# EAGLE design Schema (EAGLE 4.14)
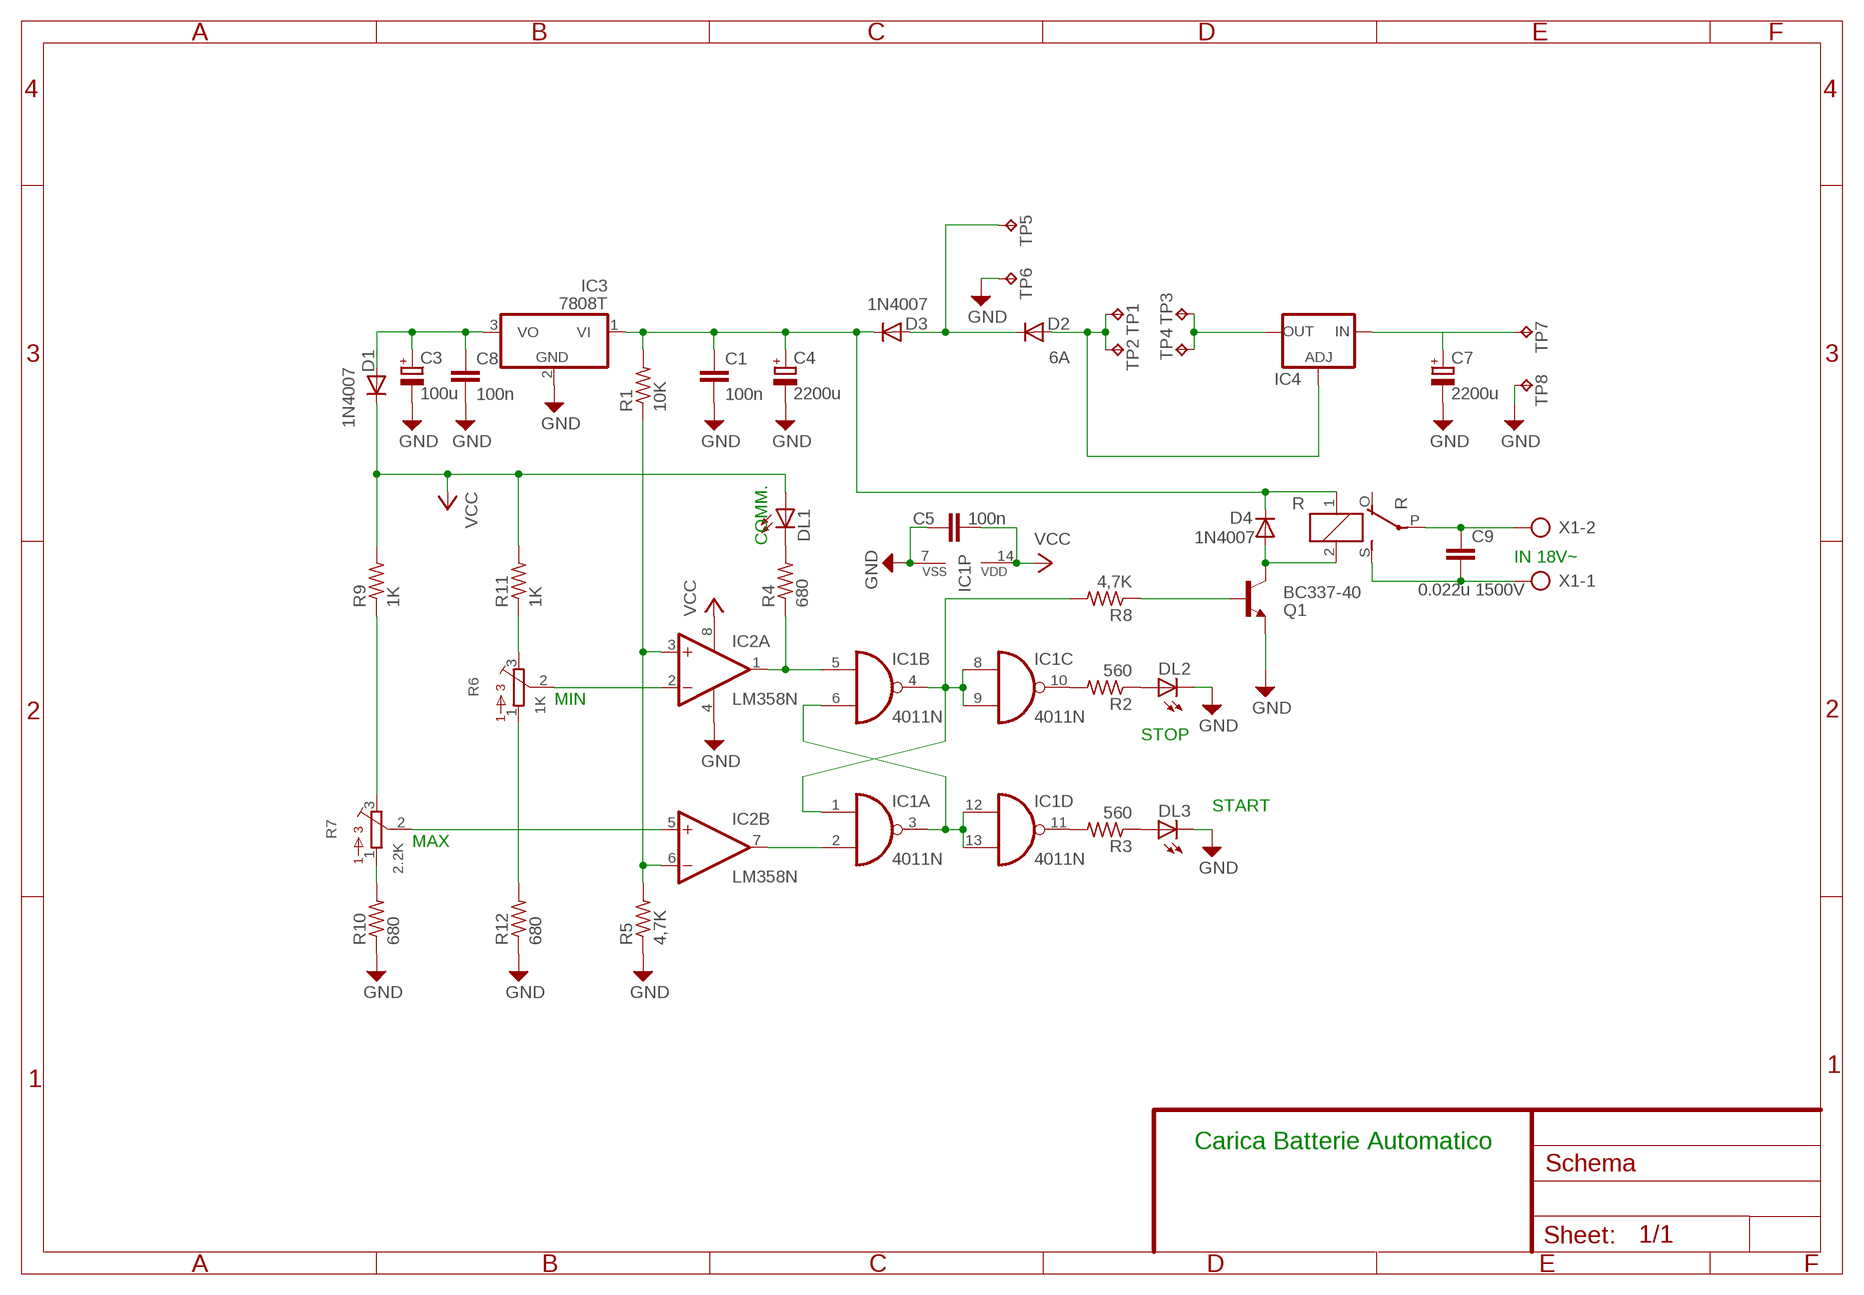
[diagram p0: schematic, sheet 1]

## Parts
C1  100n  C10/4  [C10B4]
C3  100u  CPOL-EUE5-10.5  [E5-10,5]
C4  2200u  CPOL-EUE5-13  [E5-13]
C5  100n  C-EU102-043X133  [C102-043X133]
C7  2200u  CPOL-EUE7.5-18  [E7,5-18]
C8  100n  C10/4  [C10B4]
C9  0.022u 1500V  C-EU225-087X268  [C225-087X268]
D1  1N4007  1N4004  [DO41-10]
D2  6A  MUR440RL  [C2673]
D3  1N4007  1N4004  [DO41-10]
D4  1N4007  1N4004  [DO41-10]
DL1  LED5MM  [LED5MM]
DL2  LED5MM  [LED5MM]
DL3  LED5MM  [LED5MM]
IC1  4011N  [DIL14]
IC2  LM358N  [DIL08]
IC3  7808T  [TO220H]
IC4  LM138-TO3  [TO3-K02]
Q1  BC337-40  [TO92]
R  E3206S  [E3206S]
R1  10K  R-US_0207/15  [0207/15]
R2  560  R-US_0207/15  [0207/15]
R3  560  R-US_0207/15  [0207/15]
R4  680  R-US_0207/15  [0207/15]
R5  4,7K  R-US_0207/15  [0207/15]
R6  1K  3386-G  [3386G]
R7  2.2K  3386-G  [3386G]
R8  4,7K  R-US_0207/15  [0207/15]
R9  1K  R-US_0207/15  [0207/15]
R10  680  R-US_0207/15  [0207/15]
R11  1K  R-US_0207/15  [0207/15]
R12  680  R-US_0207/15  [0207/15]
TP1  TP-052-TJ  [TJ-052]
TP2  TP-052-TJ  [TJ-052]
TP3  TP-052-TJ  [TJ-052]
TP4  TP-052-TJ  [TJ-052]
TP5  TP-052-TJ  [TJ-052]
TP6  TP-052-TJ  [TJ-052]
TP7  TP-052-TJ  [TJ-052]
TP8  TP-052-TJ  [TJ-052]
X1  AK500/2  [AK500/2]

## Nets
GND: C1.2 C3.- C4.- C5.1 C7.- C8.2 DL2.K(C) DL3.K(C) IC1.7(P:VSS) IC2.4(P:V-) IC3.2(GND) Q1.1(E) R5.1 R10.1 R12.1 TP6.1 TP8.1
N$1: IC1.5(B:I0) IC2.1(A:OUT) R4.1
N$2: IC2.2(A:-IN) R6.2
N$3: Q1.2(B) R8.1
N$4: DL1.K(C) R4.2
N$5: IC1.1(A:I0) IC1.4(B:O) IC1.8(C:I0) IC1.9(C:I1) R8.2
N$6: R6.3 R11.1
N$7: IC1.10(C:O) R2.2
N$8: IC1.11(D:O) R3.2
N$9: DL2.A R2.1
N$10: DL3.A R3.1
N$11: IC2.3(A:+IN) IC2.6(B:-IN) R1.1 R5.2
N$12: IC1.2(A:I1) IC2.7(B:OUT)
N$13: IC2.5(B:+IN) R7.2
N$14: C9.2 R.S(2:S) X1.1
N$15: D4.A Q1.3(C) R.2
N$16: R6.1 R12.2
N$17: C1.1 C4.+ D3.C D4.C IC3.1(VI) R1.2 R.1
N$18: C3.+ C8.1 D1.A IC3.3(VO)
N$19: D2.C D3.A TP5.1
N$20: R7.3 R9.1
N$21: R7.1 R10.2
N$22: D2.A IC4.2(ADJ) TP1.1 TP2.1
N$23: C7.+ IC4.1(IN) TP7.1
N$24: IC4.3(OUT) TP3.1 TP4.1
N$25: IC1.3(A:O) IC1.6(B:I1) IC1.12(D:I0) IC1.13(D:I1)
N$26: C9.1 R.P(2:P) X1.2
VCC: C5.2 D1.C DL1.A IC1.14(P:VDD) IC2.8(P:V+) R9.2 R11.2
Unconnected: R.O(2:O)

## Notes on the sheet
- COMM.
- IN 18V~
- MIN
- STOP
- START
- MAX
- Carica Batterie Automatico

## Library data of the parts
C1 C8 = capacitor-wima:C: CAPACITOR naming: grid - package width
C3 C4 C7 = rcl:CPOL-EU: POLARIZED CAPACITOR, European symbol
C5 C9 = rcl:C-EU: CAPACITOR, European symbol
D1 D3 D4 = diode:1N4004: DIODE general purpose rectifier, 1 A
D2 = diode:MUR440RL: DIODE ultra-fast recovery rectifier, Vrrm = 40 V, 4 A
DL1-DL3 = led:LED: LED OSRAM: - CHIPLED LG R971, LG N971, LY N971, LG Q971, LY Q971, LO R971, LY R971 LH N974, LH R974 LS Q976, LO Q976, LY Q976 LO Q996 - Hyper CHIPLED LW Q18S LB Q993, LB Q99A, LB R99A - SideLED LS A670, LO A670, LY A670, LG A670, LP A670 LB A673, LV A673, LT A673, LW A673 LH A674 LY A675 LS A676, LA A676, LO A676, LY A676, LW A676 LS A679, LY A679, LG A679 - Hyper Micro SIDELED® LS Y876, LA Y876, LO Y876, LY Y876 LT Y87S - SmartLED LW L88C, LW L88S LB L89C, LB L89S, LG L890 LS L89K, LO L89K, LY L89K LS L896, LA L896, LO L896, LY L896 - TOPLED LS T670, LO T670, LY T670, LG T670, LP T670 LSG T670, LSP T670, LSY T670, LOP T670, LYG T670 LG T671, LOG T671, LSG T671 LB T673, LV T673, LT T673, LW T673 LH T674 LS T676, LA T676, LO T676, LY T676, LB T676, LH T676, LSB T676, LW T676 LB T67C, LV T67C, LT T67C, LS T67K, LO T67K, LY T67K, LW E67C LS E67B, LA E67B, LO E67B, LY E67B, LB E67C, LV E67C, LT E67C LW T67C LS T679, LY T679, LG T679 LS T770, LO T770, LY T770, LG T770, LP T770 LB T773, LV T773, LT T773, LW T773 LH T774 LS E675, LA E675, LY E675, LS T675 LS T776, LA T776, LO T776, LY T776, LB T776 LHGB T686 LT T68C, LB T68C - Hyper Mini TOPLED® LB M676 - Mini TOPLED Santana® LG M470 LS M47K, LO M47K, LY M47K Source: http://www.osram.convergy.de/
IC1 = 40xx:4011: Quad 2-input NAND
IC2 = linear:LM358: OP AMP
IC3 = linear3:78*: Positive VOLTAGE REGULATOR Source: http://cache.national.com/ds/LM/LM78L05.pdf http://www.fairchildsemi.com/ds/LM/LM7805.pdf
IC4 = v-reg:LM138-TO3: VOLTAGE REGULATOR
Q1 = transistor-npn:BC337*: NPN Transistor
R = relay:E3206S: RELAY 1 x switch, Eichhoff/distributor Schukat
R1-R5 R8-R12 = rcl:R-US_: RESISTOR, American symbol
R6 R7 = BOURNS:3386-: 3386 Series 3/8" Square Trimmer
TP1-TP8 = keystone:TP: TEST POINT PCB Vertical Mount
X1 = con-ptr500:AK500/2: CONNECTOR

## Board
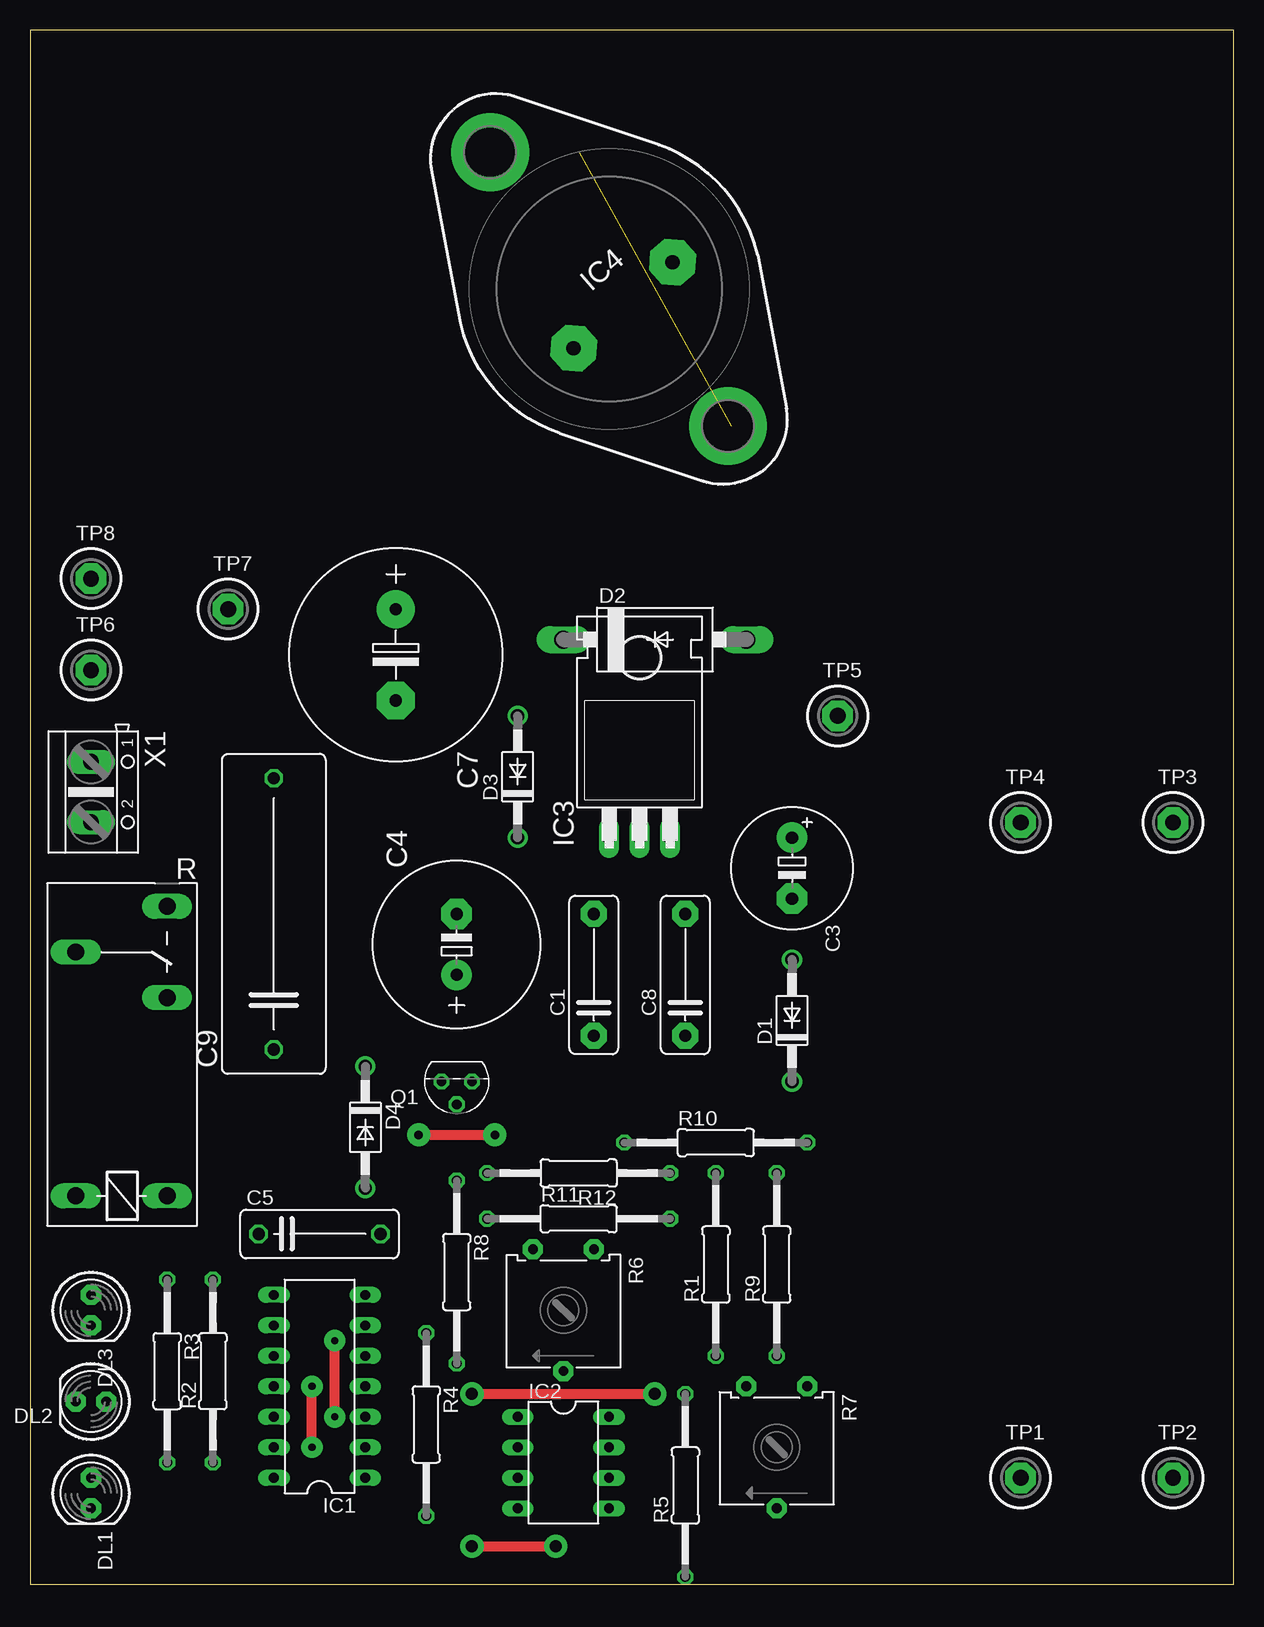
[diagram p1: board, top side]
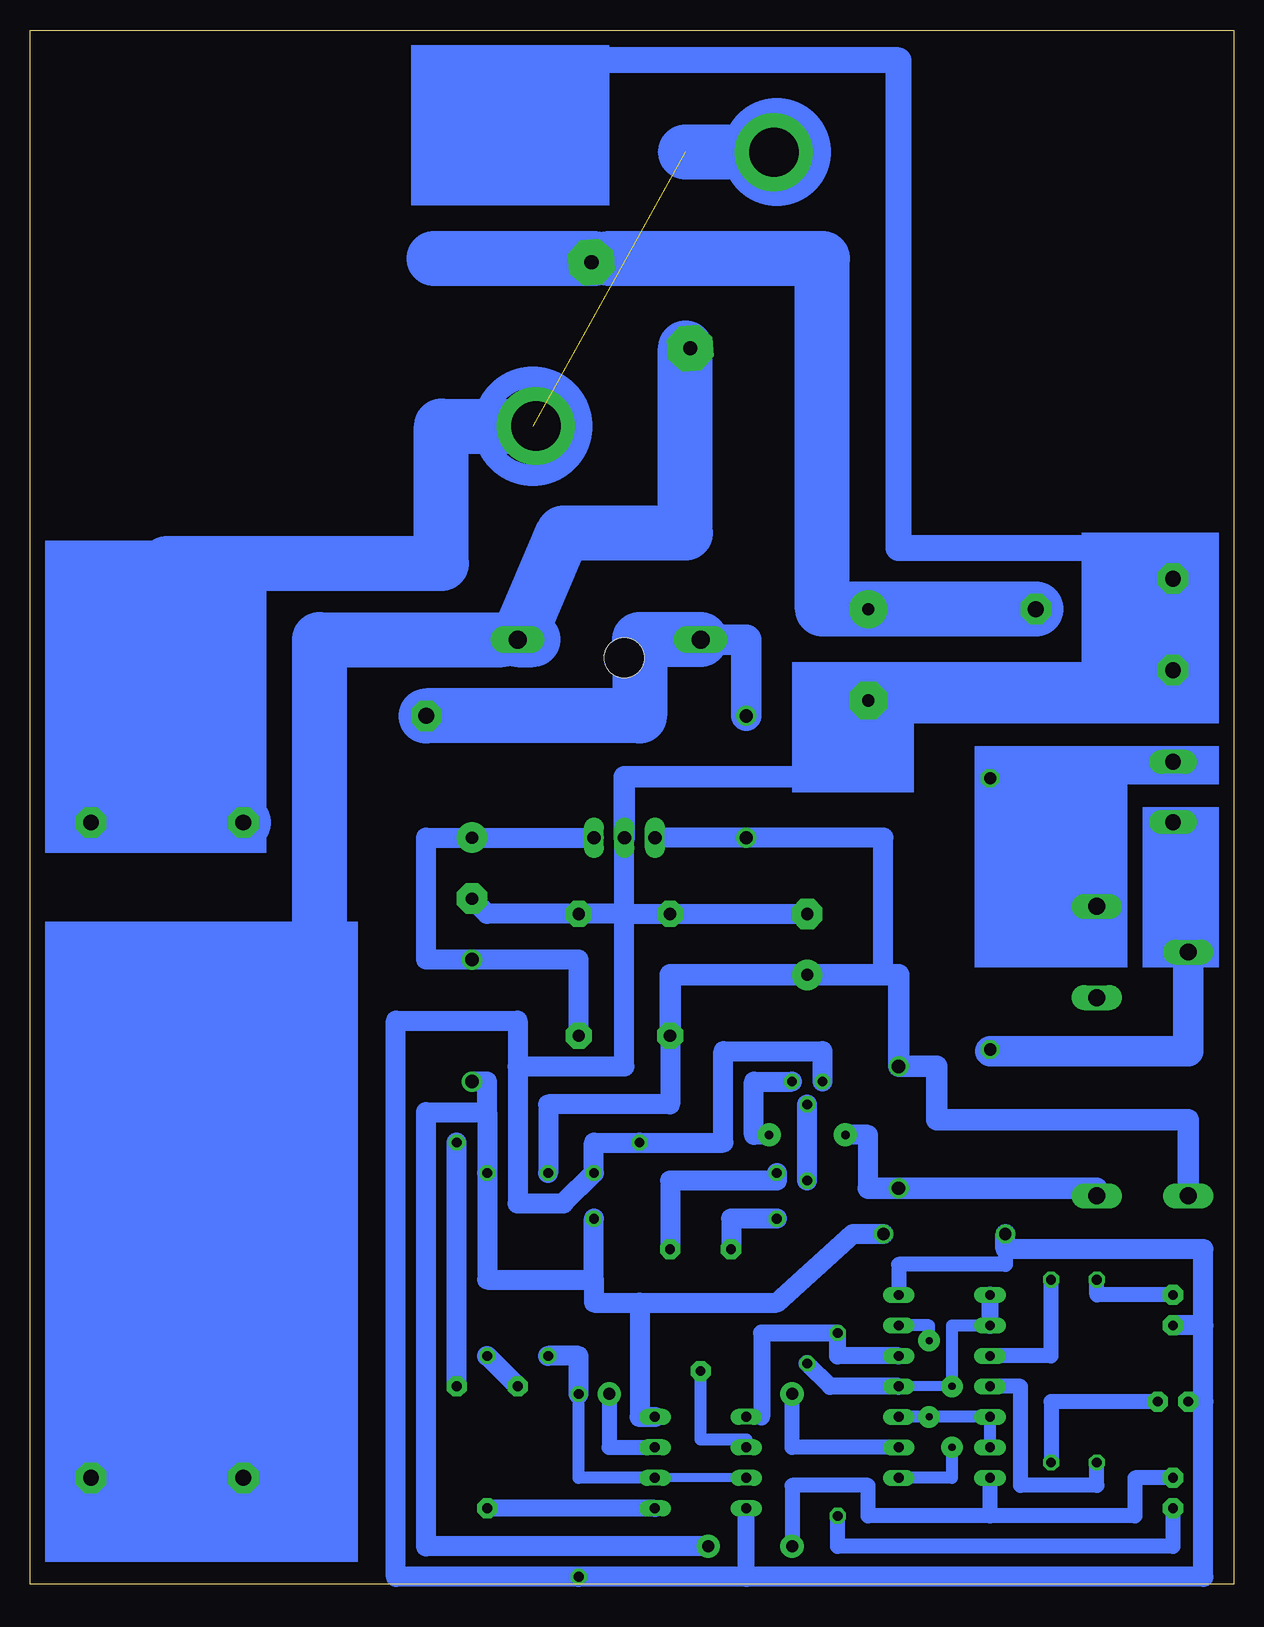
[diagram p2: board, bottom side, seen from below]

Size 100.33 x 129.54 mm. Coordinates in mm from the lower left corner, seen from the top.
Outline: 0,0 100.33,0 100.33,129.54 0,129.54 0,0
Copper layers (1*16): Top 0.035mm / dielectric 1.5mm / Bottom 0.035mm
Design rules "default": minimum track width 30mil, minimum drill 24mil, track to track 8mil, track to pad 8mil, pad to pad 8mil, via to via 8mil, smd to smd 8mil, copper to edge 40mil, drill to drill 8mil, minimum pad ring 10mil, minimum via ring 8mil, stop-mask expansion 4mil, vias tented up to drill 0mil, thermal gap 10mil

### Footprints (pad centres in the part's own frame; a part is rotated, then mirrored left to right if it is on the bottom)
C10B4 = drill 1.016 pad 2.159 octagon: 1 -5.08,0; 2 5.08,0
E5-10,5 = drill 1.016 pad 2.54 round: + -2.54,0 | drill 1.016 pad 2.54 octagon: - 2.54,0
E5-13 = drill 1.016 pad 2.54 round: + -2.54,0 | drill 1.016 pad 2.54 octagon: - 2.54,0
C102-043X133 = drill 1.016 octagon: 1 -5.08,0; 2 5.08,0
E7,5-18 = drill 1.016 pad 3.15 round: + -3.81,0 | drill 1.016 pad 3.15 octagon: - 3.81,0
C225-087X268 = drill 1.016 octagon: 1 -11.303,0; 2 11.303,0
DO41-10 = drill 1.118 round: A 5.08,0; C -5.08,0
C2673 = drill 1.499 long: A 7.62,0; C -7.62,0
LED5MM = drill 0.813 pad 1.676 octagon: A -1.27,0; K 1.27,0
DIL14 = drill 0.813 long: 1 -7.62,-3.81; 2 -5.08,-3.81; 3 -2.54,-3.81; 4 0,-3.81; 5 2.54,-3.81; 6 5.08,-3.81; 7 7.62,-3.81; 8 7.62,3.81; 9 5.08,3.81; 10 2.54,3.81; 11 0,3.81; 12 -2.54,3.81; 13 -5.08,3.81; 14 -7.62,3.81
DIL08 = drill 0.813 long: 1 -3.81,-3.81; 2 -1.27,-3.81; 3 1.27,-3.81; 4 3.81,-3.81; 5 3.81,3.81; 6 1.27,3.81; 7 -1.27,3.81; 8 -3.81,3.81
TO220H = drill 1.118 long: 1 -2.54,-10.16; 2 0,-10.16; 3 2.54,-10.16 | hole 3.302: 0,4.826
TO3-K02 = drill 1.194 pad 3.81 octagon: 1 -1.778,-5.461; 2 -1.778,5.461 | drill 4.115 pad 6.477 round: 3 15.113,0; 3@ -15.113,0
TO92 = drill 0.813 octagon: 1 1.27,0; 2 0,1.905; 3 -1.27,0
E3206S = drill 1.397 long: 1 -3.175,3.81; 2 -3.175,-3.81; O 13.335,-3.81; P 17.145,3.81; S 20.955,-3.81
0207/15 = drill 0.813 octagon: 1 -7.62,0; 2 7.62,0
3386G = drill 0.813 pad 1.676 octagon: 1 -2.54,-5.08; 2 0,5.08; 3 2.54,-5.08
TJ-052 = drill 1.321 pad 2.54 octagon: 1 0,0
AK500/2 = drill 1.321 long: 1 -2.515,0; 2 2.515,0

### Placement (x,y rotation side)
C1  46.99,50.8 90 top
C3  63.5,59.69 270 top
C4  35.56,53.34 90 top
C5  24.13,29.21 0 top
C7  30.48,77.47 270 top
C8  54.61,50.8 90 top
C9  20.32,55.88 90 top
D1  63.5,46.99 90 top
D2  52.07,78.74 0 top
D3  40.64,67.31 90 top
D4  27.94,38.1 270 top
DL1  5.08,7.62 270 top
DL2  5.08,15.24 180 top
DL3  5.08,22.86 270 top
IC1  24.13,16.51 90 top
IC2  44.45,10.16 270 top
IC3  50.8,72.39 0 top
IC4  48.26,107.95 131 top
Q1  35.56,41.91 180 top
R  7.62,35.56 90 top
R1  57.15,26.67 90 top
R2  15.24,17.78 90 top
R3  11.43,17.78 270 top
R4  33.02,13.33 270 top
R5  54.61,8.25 90 top
R6  44.45,22.86 180 top
R7  62.23,11.43 180 top
R8  35.56,26.04 270 top
R9  62.23,26.67 90 top
R10  57.15,36.83 0 top
R11  45.72,30.48 0 top
R12  45.72,34.29 180 top
TP1  82.55,8.89 0 top
TP2  95.25,8.89 0 top
TP3  95.25,63.5 0 top
TP4  82.55,63.5 0 top
TP5  67.31,72.39 0 top
TP6  5.08,76.2 0 top
TP7  16.51,81.28 0 top
TP8  5.08,83.82 0 top
X1  5.08,66.04 270 top

### Tracks (layer width: path | path; a pad name or v marks a point on that pad's centre or on a via)
GND
  Bottom 0.762: C7.- 29.21,73.66
  Bottom 1.27: IC1.7 27.94,26.67 19.05,26.67 19.05,27.94
  Bottom 1.422: 40.64,0.64 IC2.4
  Bottom 1.676: 2.54,21.59 DL3.K | 2.54,15.24 2.54,0.64 40.64,0.64 R5.1 69.85,0.64 69.85,46.99 59.69,46.99 59.69,43.18 | 2.54,15.24 DL2.K | 50.8,55.88 IC3.2 | 50.8,55.88 C8.2 62.23,55.88 C3.- | 50.8,55.88 C1.2 | 50.8,55.88 C4.- | 59.69,43.18 59.69,31.75 55.88,31.75 R12.1 53.34,36.83 R10.1 42.55,36.83 42.55,44.45 34.29,44.45 Q1.1 | 2.54,15.24 2.54,21.59 | 2.54,21.59 2.54,27.94 19.05,27.94 C5.1 | 50.8,55.88 50.8,43.18 59.69,43.18
  Bottom 1.778: IC3.2 50.8,67.31 30.48,67.31 C7.-
  Bottom 2.184: 29.21,73.66 11.43,73.66 11.43,76.2 | 11.43,76.2 11.43,86.36 27.94,86.36 27.94,127 59.69,127 | 11.43,76.2 TP6.1 TP8.1
N$1
  Bottom 1.27: 39.37,13.97 IC2.1
  Bottom 1.422: 39.37,13.97 39.37,20.95 R4.1 33.02,19.05 IC1.5
N$2
  Bottom 1.016: IC2.2 40.64,12.06 44.45,12.06 R6.2
N$3
  Bottom 1.676: R8.1 Q1.2
N$4
  Bottom 1.27: DL1.K 5.08,3.17 33.02,3.17 R4.2
N$5  (via drill 0.6 pad 1.78)
  Top 0.813: v23.49,11.43 v23.49,16.51
  Bottom 0.813: v23.49,16.51 IC1.4
  Bottom 1.016: v23.49,16.51 23.49,21.59 IC1.9 | IC1.1 23.49,8.89 v23.49,11.43
  Bottom 1.422: IC1.9 IC1.8 | R8.2 33.66,16.51 IC1.4
N$6
  Bottom 1.676: R11.1 41.91,30.48 R6.3
N$7
  Bottom 1.27: IC1.10 15.24,19.05 R2.2
N$8
  Bottom 1.27: IC1.11 17.78,16.51 17.78,8.25 11.43,8.25 R3.2
N$9
  Bottom 1.27: R2.1 15.24,15.24 DL2.A
N$10
  Bottom 1.27: DL3.A 11.43,24.13 R3.1
N$11
  Bottom 0.762: IC2.3 IC2.6
  Bottom 1.016: IC2.6 54.61,8.89 R5.2
  Bottom 1.676: R1.1 54.61,19.05 R5.2
N$12  (via drill 1 pad 1.93)
  Top 0.813: v36.83,15.88 v52.07,15.88
  Bottom 1.27: IC1.2 36.83,11.43 v36.83,15.88 | v52.07,15.88 52.07,11.43 IC2.7
N$13
  Bottom 1.422: IC2.5 R7.2
N$14
  Bottom 0.762: R.S 11.43,68.58
  Bottom 2.54: X1.1 6.35,68.58 11.43,68.58 20.32,68.58 C9.2
N$15  (via drill 0.7 pad 1.93)
  Top 0.813: v32.39,37.47 v38.73,37.47
  Bottom 1.676: 30.48,33.02 30.48,37.47 v32.39,37.47 | v38.73,37.47 40.01,37.47 40.01,41.91 Q1.3
  Bottom 1.778: 30.48,33.02 D4.A 11.43,33.02 R.2
N$16
  Bottom 1.676: R12.2 38.1,33.66 46.99,33.66 R6.1
N$17
  Bottom 1.676: IC3.1 D3.C 29.21,62.23 29.21,50.8 C4.+ | C1.1 46.99,40.01 57.15,40.01 R1.2
  Bottom 1.778: C1.1 46.99,50.8 C4.+ 27.94,50.8 D4.C 24.76,43.18 24.76,38.73 3.81,38.73 R.1
N$18
  Bottom 1.676: IC3.3 C3.+ 67.31,62.23 67.31,52.07 D1.A 54.61,52.07 C8.1
N$19
  Bottom 2.54: D3.A 40.64,78.74 D2.C
  Bottom 4.572: TP5.1 49.53,72.39 49.53,78.74 D2.C
N$20
  Bottom 1.676: R7.3 R9.1
N$21
  Bottom 1.676: R7.1 R10.2
N$22
  Bottom 0.762: 60.96,78.74 D2.A
  Bottom 1.27: 45.72,103.02 IC4.2
  Bottom 4.572: TP1.1 88.9,8.89 | 88.9,8.89 TP2.1 | 58.42,78.74 D2.A 55.88,87.63 45.72,87.63 45.72,103.02 | 60.96,78.74 76.2,78.74 76.2,49.53 88.9,49.53 88.9,8.89
N$23
  Bottom 0.762: 52.07,110.49 IC4.1
  Bottom 4.572: TP7.1 C7.+ 34.29,81.28 34.29,110.49 52.07,110.49
N$24  (1 unrouted)
  Bottom 4.572: 88.9,63.5 TP3.1 | TP4.1 88.9,63.5 | 88.9,63.5 88.9,85.09 66.04,85.09 66.04,96.52 58.42,96.52 | IC4.3 45.72,119.36 45.72,119.38
N$25  (via drill 0.6 pad 1.78)
  Top 0.813: v25.4,13.97 v25.4,20.32
  Bottom 1.016: IC1.13 IC1.12 v25.4,13.97 IC1.3 | IC1.6 25.4,21.59 v25.4,20.32
N$26
  Bottom 0.762: R.P 5.08,53.34 | 20.32,44.45 C9.1
  Bottom 1.778: 5.08,53.34 X1.2
  Bottom 2.54: 20.32,44.45 3.81,44.45 R.P
N$27
  Bottom 4.572: 53.34,110.49 66.67,110.49
VCC  (via drill 1 pad 1.93)
  Top 0.813: v36.83,3.17 v43.82,3.17
  Bottom 1.27: DL1.A 8.25,8.89 8.25,5.72 20.32,5.72 | 20.32,5.72 IC1.14 | 20.32,5.72 30.48,5.72 30.48,8.25 36.83,8.25 v36.83,3.17
  Bottom 1.676: 62.23,39.37 62.23,41.91 D1.C | 62.23,39.37 R9.2 62.23,25.4 53.34,25.4 | 62.23,39.37 67.31,39.37 67.31,3.17 v43.82,3.17 | 53.34,25.4 R11.2 | 49.53,23.49 38.1,23.49 31.75,29.21 C5.2 | IC2.8 49.53,13.97 49.53,23.49 | 49.53,23.49 53.34,23.49 53.34,25.4
(copper drawn outside any net)
  shapes: Bottom area x9, Bottom circle x2